# EAGLE schematic M452X (EAGLE 6.6.0)
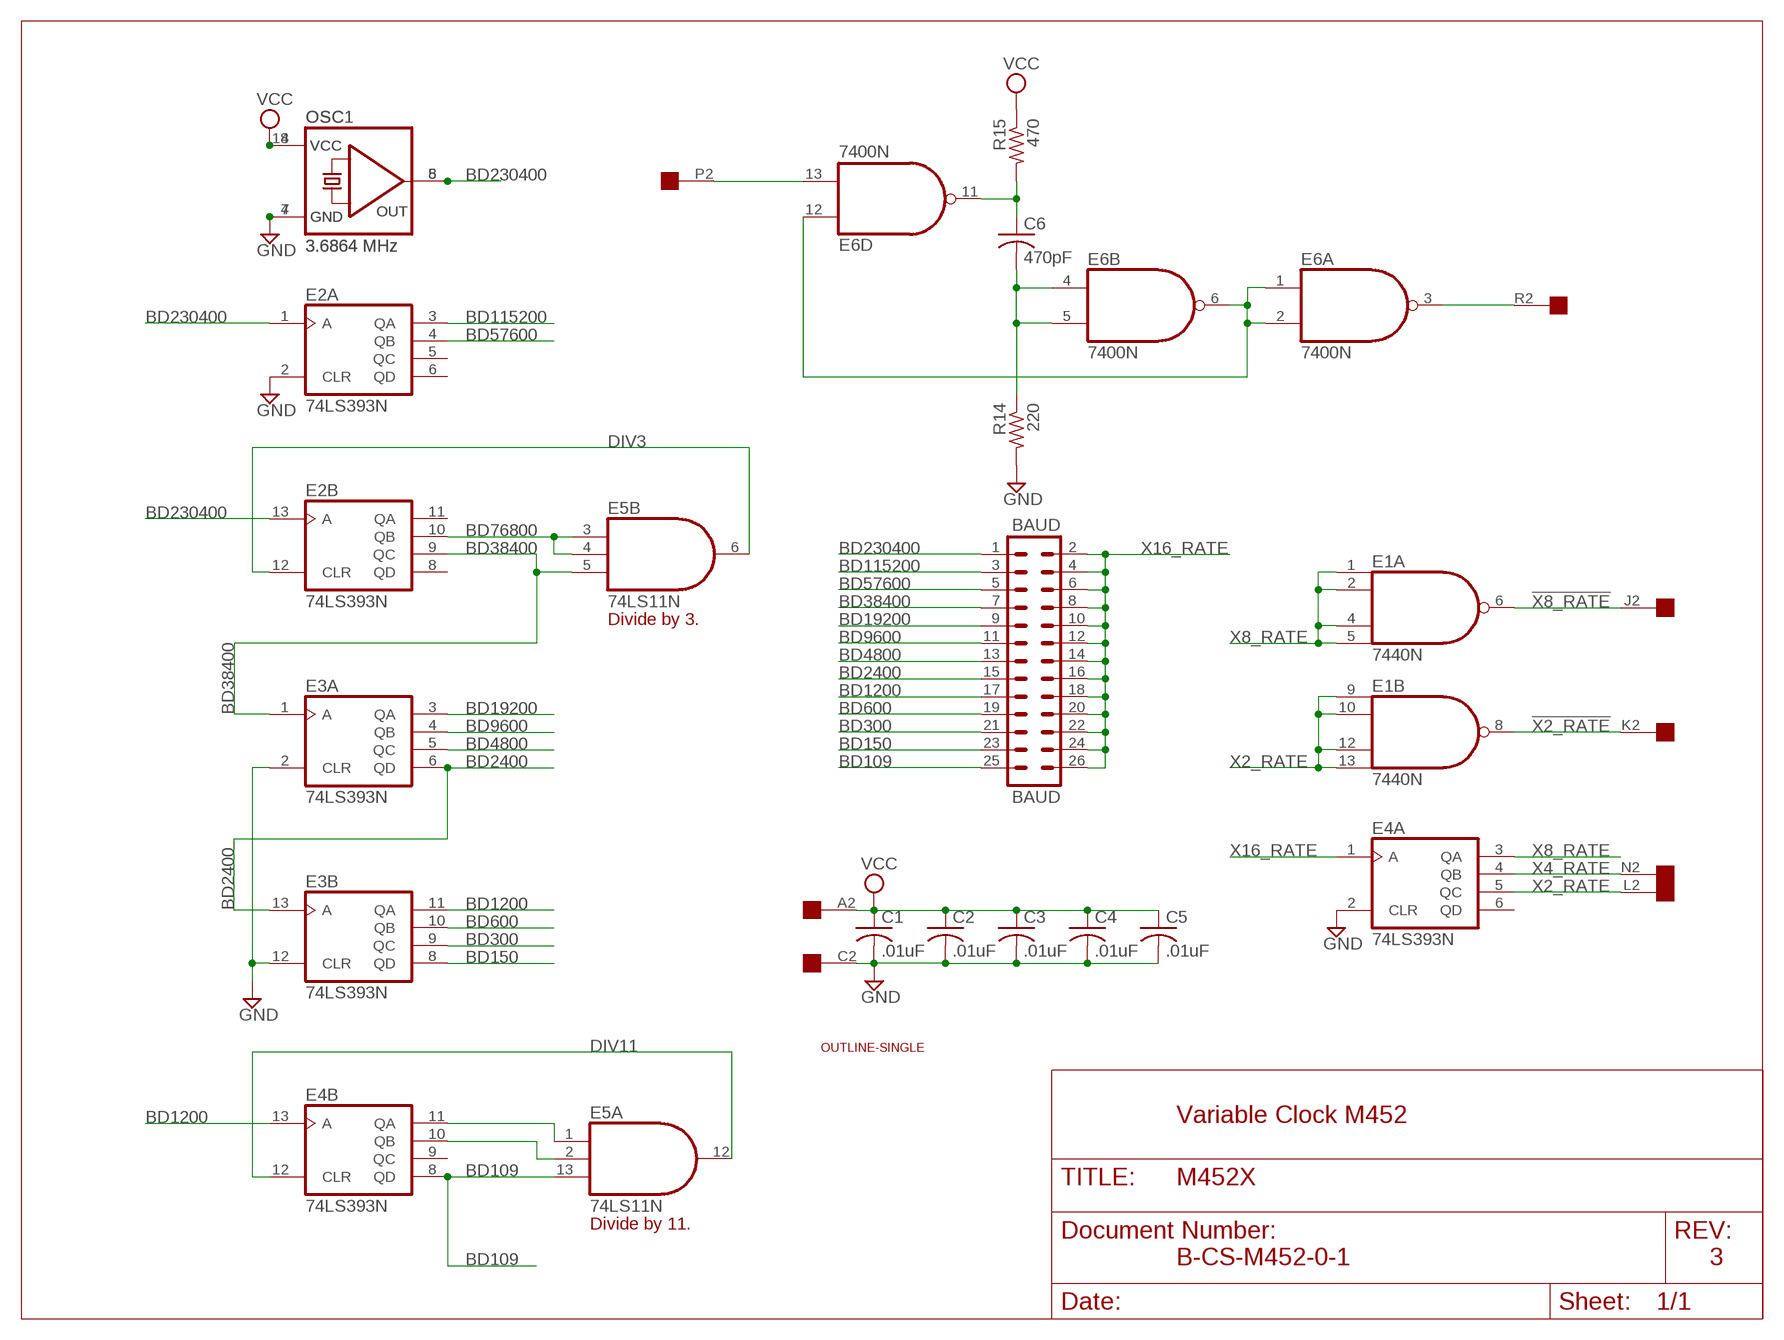
[diagram p0: schematic, sheet 1]

## Parts
BAUD  BAUD  MA13-2  [MA13-2]
C1  .01uF  C-US050-025X075  [C050-025X075]
C2  .01uF  C-US050-025X075  [C050-025X075]
C3  .01uF  C-US050-025X075  [C050-025X075]
C4  .01uF  C-US050-025X075  [C050-025X075]
C5  .01uF  C-US050-025X075  [C050-025X075]
C6  470pF  C-US075-032X103  [C075-032X103]
E1  7440N  74S20N  [DIL14]
E2  74LS393N  [DIL14]
E3  74LS393N  [DIL14]
E4  74LS393N  [DIL14]
E5  74LS11N  [DIL14]
E6  7400N  74LS00N  [DIL14]
OSC  3.6864 MHz  QG5460  [DIL08S]
OSC1  3.6864 MHz  QG5860  [DIL14S]
R14  220  R-US_0207/10  [0207/10]
R15  470  R-US_0207/10  [0207/10]
U$1  OUTLINE-SINGLE  [SINGLE]
U$2  EDGE-1  [EDGE-CON1]

## Nets
!X2_RATE: E1.8(B:O) U$2.K2
!X8_RATE: E1.6(A:O) U$2.J2
BD109: BAUD.25 E4.8(B:QD) E5.13(A:I2)
BD150: BAUD.23 E3.8(B:QD)
BD300: BAUD.21 E3.9(B:QC)
BD600: BAUD.19 E3.10(B:QB)
BD1200: BAUD.17 E3.11(B:QA) E4.13(B:A)
BD2400: BAUD.15 E3.6(A:QD) E3.13(B:A)
BD4800: BAUD.13 E3.5(A:QC)
BD9600: BAUD.11 E3.4(A:QB)
BD19200: BAUD.9 E3.3(A:QA)
BD38400: BAUD.7 E2.9(B:QC) E3.1(A:A) E5.5(B:I2)
BD57600: BAUD.5 E2.4(A:QB)
BD76800: E2.10(B:QB) E5.3(B:I0) E5.4(B:I1)
BD115200: BAUD.3 E2.3(A:QA)
BD230400: BAUD.1 E2.1(A:A) E2.13(B:A) OSC1.8(OUT) OSC.5(OUT)
DIV3 [Supply]: E2.12(B:CLR) E5.6(B:O)
DIV11: E4.12(B:CLR) E5.12(A:O)
GND [Supply]: C1.2 C2.2 C3.2 C4.2 C5.2 E2.2(A:CLR) E3.2(A:CLR) E3.12(B:CLR) E4.2(A:CLR) OSC1.7(GND) OSC.4(GND) R14.2 U$2.C2
N$12: E6.13(D:I1) U$2.P2
N$14: C6.2 E6.4(B:I0) E6.5(B:I1) R14.1
N$16: C6.1 E6.11(D:O) R15.2
N$17: E6.1(A:I0) E6.2(A:I1) E6.6(B:O) E6.12(D:I0)
N$21: E6.3(A:O) U$2.R2
N$24: E4.11(B:QA) E5.1(A:I0)
N$25: E4.10(B:QB) E5.2(A:I1)
VCC [Supply]: C1.1 C2.1 C3.1 C4.1 C5.1 OSC1.14(VCC) OSC.8(VCC) R15.1 U$2.A2
X2_RATE: E1.9(B:I0) E1.10(B:I1) E1.12(B:I2) E1.13(B:I3) E4.5(A:QC) U$2.L2
X4_RATE: E4.4(A:QB) U$2.N2
X8_RATE: E1.1(A:I0) E1.2(A:I1) E1.4(A:I2) E1.5(A:I3) E4.3(A:QA)
X16_RATE: BAUD.2 BAUD.4 BAUD.6 BAUD.8 BAUD.10 BAUD.12 BAUD.14 BAUD.16 BAUD.18 BAUD.20 BAUD.22 BAUD.24 BAUD.26 E4.1(A:A)
Unconnected: E2.5(A:QC) E2.6(A:QD) E2.8(B:QD) E2.11(B:QA) E4.6(A:QD) E4.9(B:QC) E5.8(C:O) E5.9(C:I0) E5.10(C:I1) E5.11(C:I2) E6.8(C:O) E6.9(C:I0) E6.10(C:I1) U$2.B2 U$2.D2 U$2.E2 U$2.F2 U$2.H2 U$2.M2 U$2.S2 U$2.T2 U$2.U2 U$2.V2

## Notes on the sheet
- Divide by 3.
- Variable Clock M452
- Divide by 11.
- B-CS-M452-0-1 | 3

## Power pins joined to a net without a drawn wire
GND: E1.7(P:GND) E2.7(P:GND) E3.7(P:GND) E4.7(P:GND) E5.7(P:GND) E6.7(P:GND)
VCC: E1.14(P:VCC) E2.14(P:VCC) E3.14(P:VCC) E4.14(P:VCC) E5.14(P:VCC) E6.14(P:VCC)

## Library data of the parts
BAUD = con-lstb:MA13-2: PIN HEADER; OC_FARNELL: unknown; OC_NEWARK: unknown
C1-C6 = rcl:C-US: CAPACITOR, American symbol
E1 = 74xx-us:74*20: Dual 4-input NAND gate
E2-E4 = 74xx-us:74*393: Dual 4-bit decade and binary COUNTER
E5 = 74xx-us:74*11: Triple 3-input AND gate
E6 = 74xx-us:74*00: Quad 2-input NAND gate
OSC = crystal:QG5460: CRYSTAL RESONATOR; OC_FARNELL: unknown; OC_NEWARK: unknown
OSC1 = crystal:QG5860: CRYSTAL RESONATOR; OC_FARNELL: unknown; OC_NEWARK: unknown
R14 R15 = rcl:R-US_: RESISTOR, American symbol
U$1 = dec-con:OUTLINE-*: Board outlines for DEC boards.
U$2 = dec-con:EDGE-1: Single-Sided DEC Edge Connector -- (side 2)

## Net classes
1 Supply: width 0.813 mm